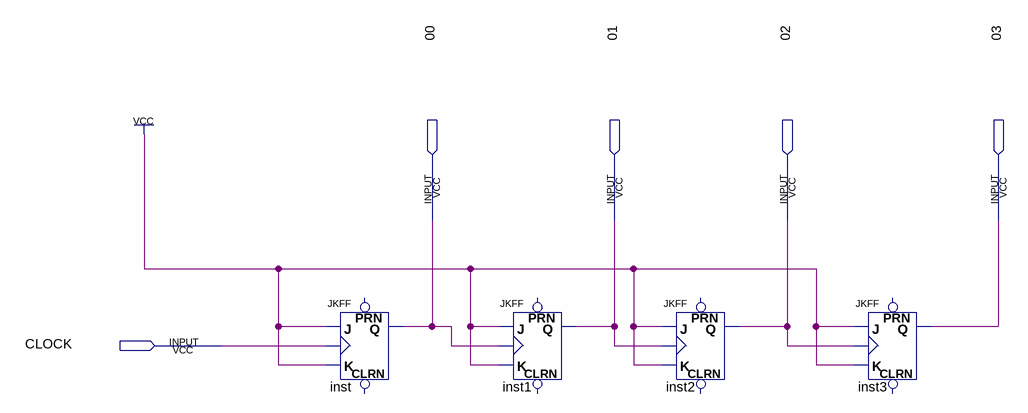
[diagram p0: schematic sheet]
// Quartus schematic assicrono.bdf as structural Verilog: 4 symbols, 5 pins
module assicrono (
  input  \00 ,
  input  \01 ,
  input  \02 ,
  input  \03 ,
  input  CLOCK
);

  JKFF inst (.K(1'b1), .J(1'b1), .CLK(CLOCK), .Q(\00 ));  // open: PRN, CLRN
  JKFF inst1 (.K(1'b1), .J(1'b1), .CLK(\00 ), .Q(\01 ));  // open: PRN, CLRN
  JKFF inst2 (.K(1'b1), .J(1'b1), .CLK(\01 ), .Q(\02 ));  // open: PRN, CLRN
  JKFF inst3 (.K(1'b1), .J(1'b1), .CLK(\02 ), .Q(\03 ));  // open: PRN, CLRN
endmodule
